# EAGLE schematic seamonster_smd_draft1 (EAGLE 8.2.1)

## Sheet 1 of 4: Power Section
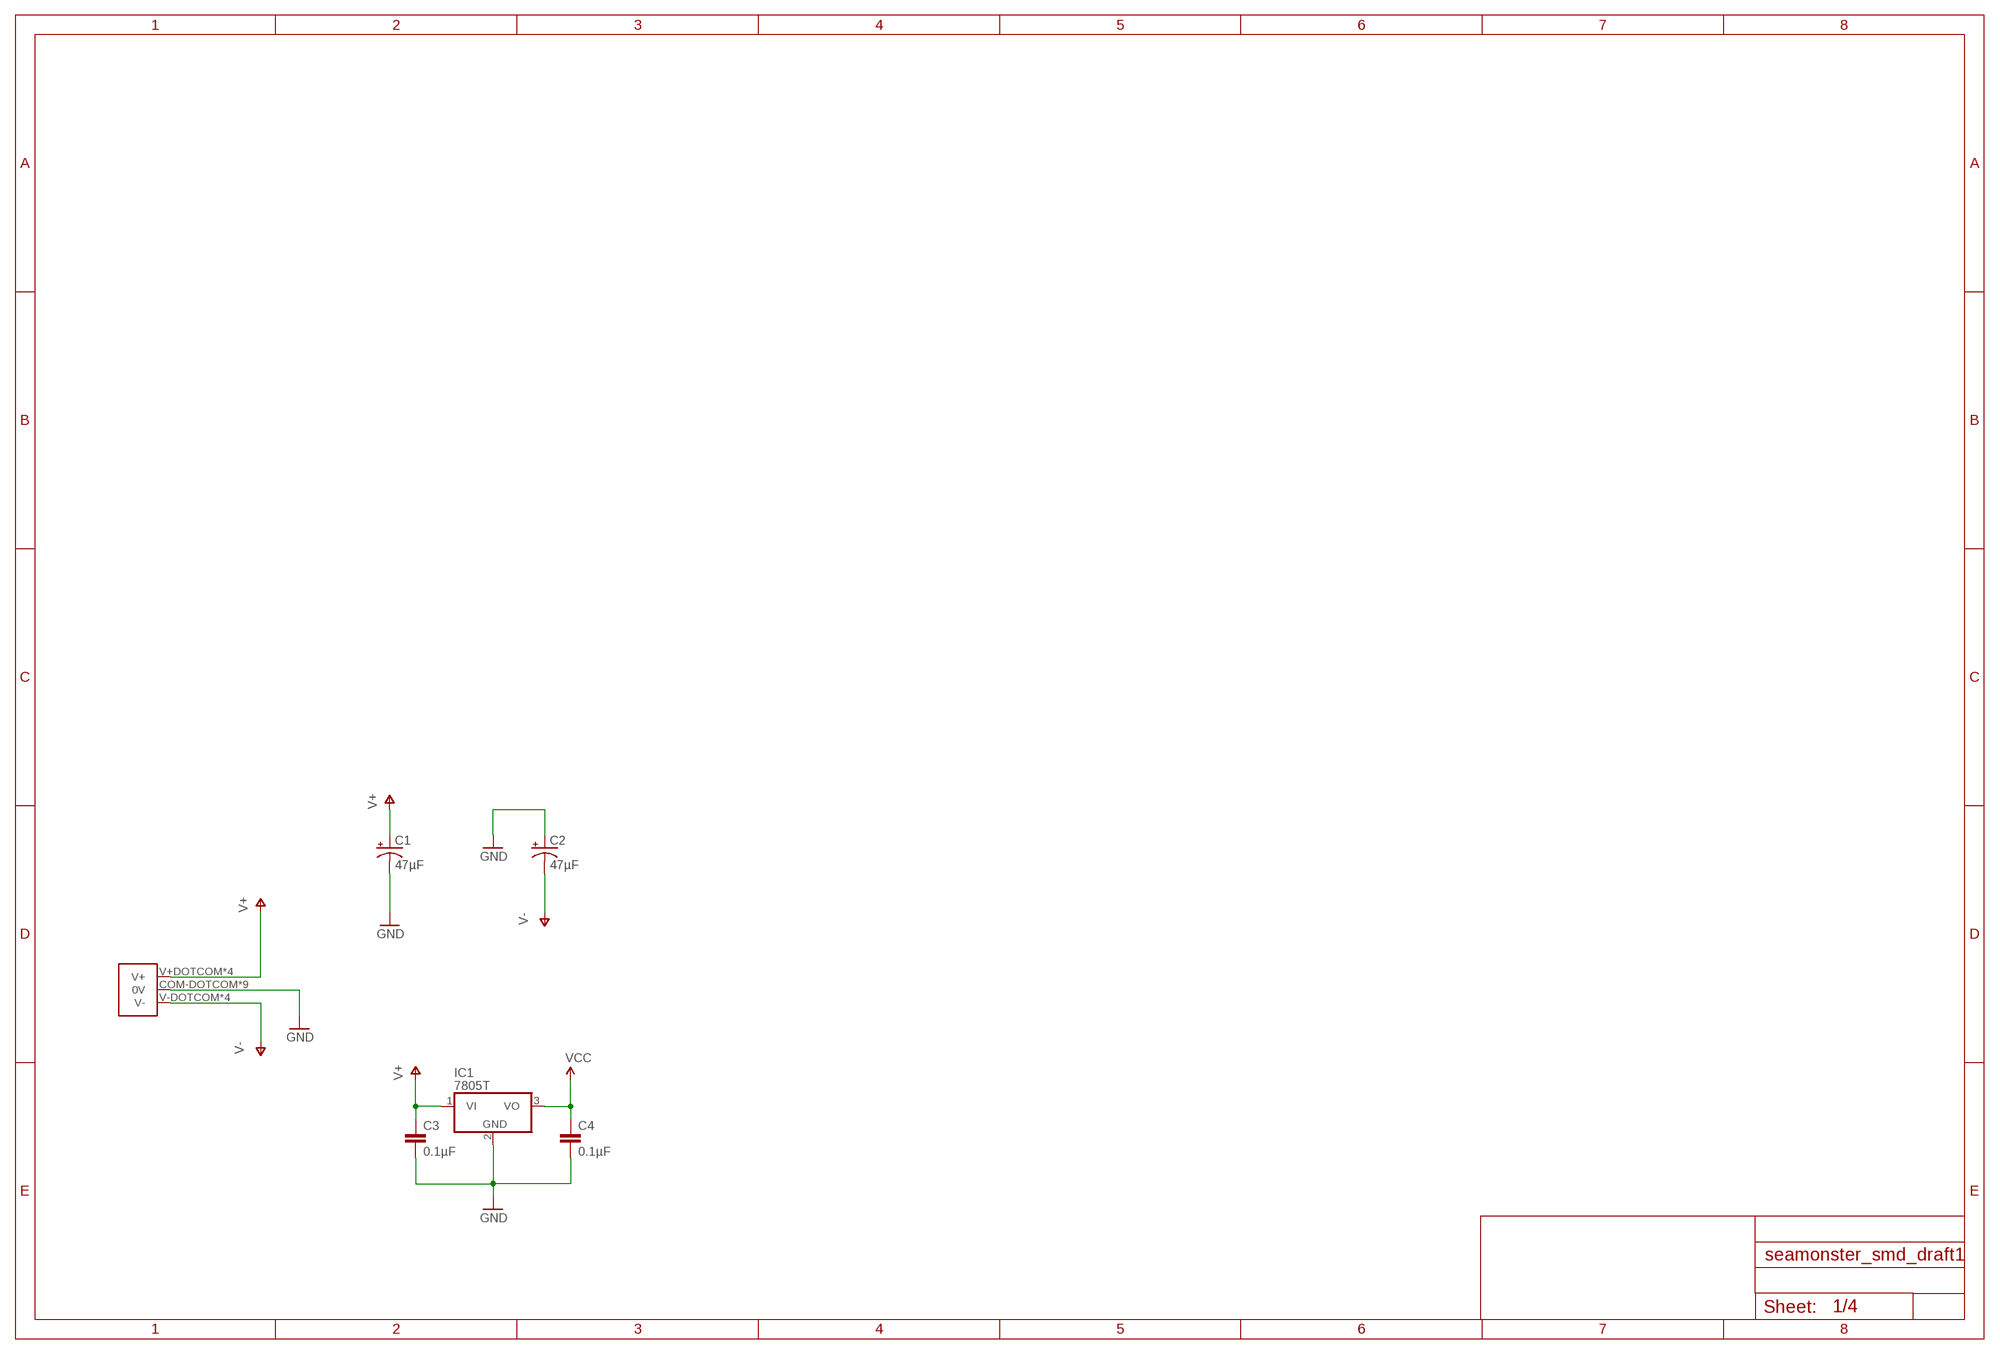
[diagram p0: schematic, sheet 1]

### Parts
C1  47µF  CAP_POLPTH2  [CPOL-RADIAL-10UF-25V]
C2  47µF  CAP_POLPTH2  [CPOL-RADIAL-10UF-25V]
C3  0.1µF  CAP0805  [0805]
C4  0.1µF  CAP0805  [0805]
IC1  7805T  [TO220H]
U$1  COMBO_POWER  [COMBO_POWER]

### Nets
GND: C1.2(-) C2.1(+) C3.2 C4.2 IC1.2(GND) U$1.COM-DOTCOM(0V) U$1.COM-EURO1(0V) U$1.COM-EURO2(0V) U$1.COM-EURO3(0V) U$1.COM-EURO4(0V) U$1.COM-EURO5(0V) U$1.COM-EURO6(0V) U$1.COM-MOTM1(0V) U$1.COM_MOTM2(0V) ; also sheet 2
V+: C1.1(+) C3.1 IC1.1(VI) U$1.V+DOTCOM(V+) U$1.V+EURO1(V+) U$1.V+EURO2(V+) U$1.V+MOTM(V+) ; also sheet 2
V-: C2.2(-) U$1.V-DOTCOM(V-) U$1.V-EURO1(V-) U$1.V-EURO2(V-) U$1.V-MOTM(V-) ; also sheet 2
VCC: C4.1 IC1.3(VO) ; also sheet 2

## Sheet 2 of 4: Multiplexing
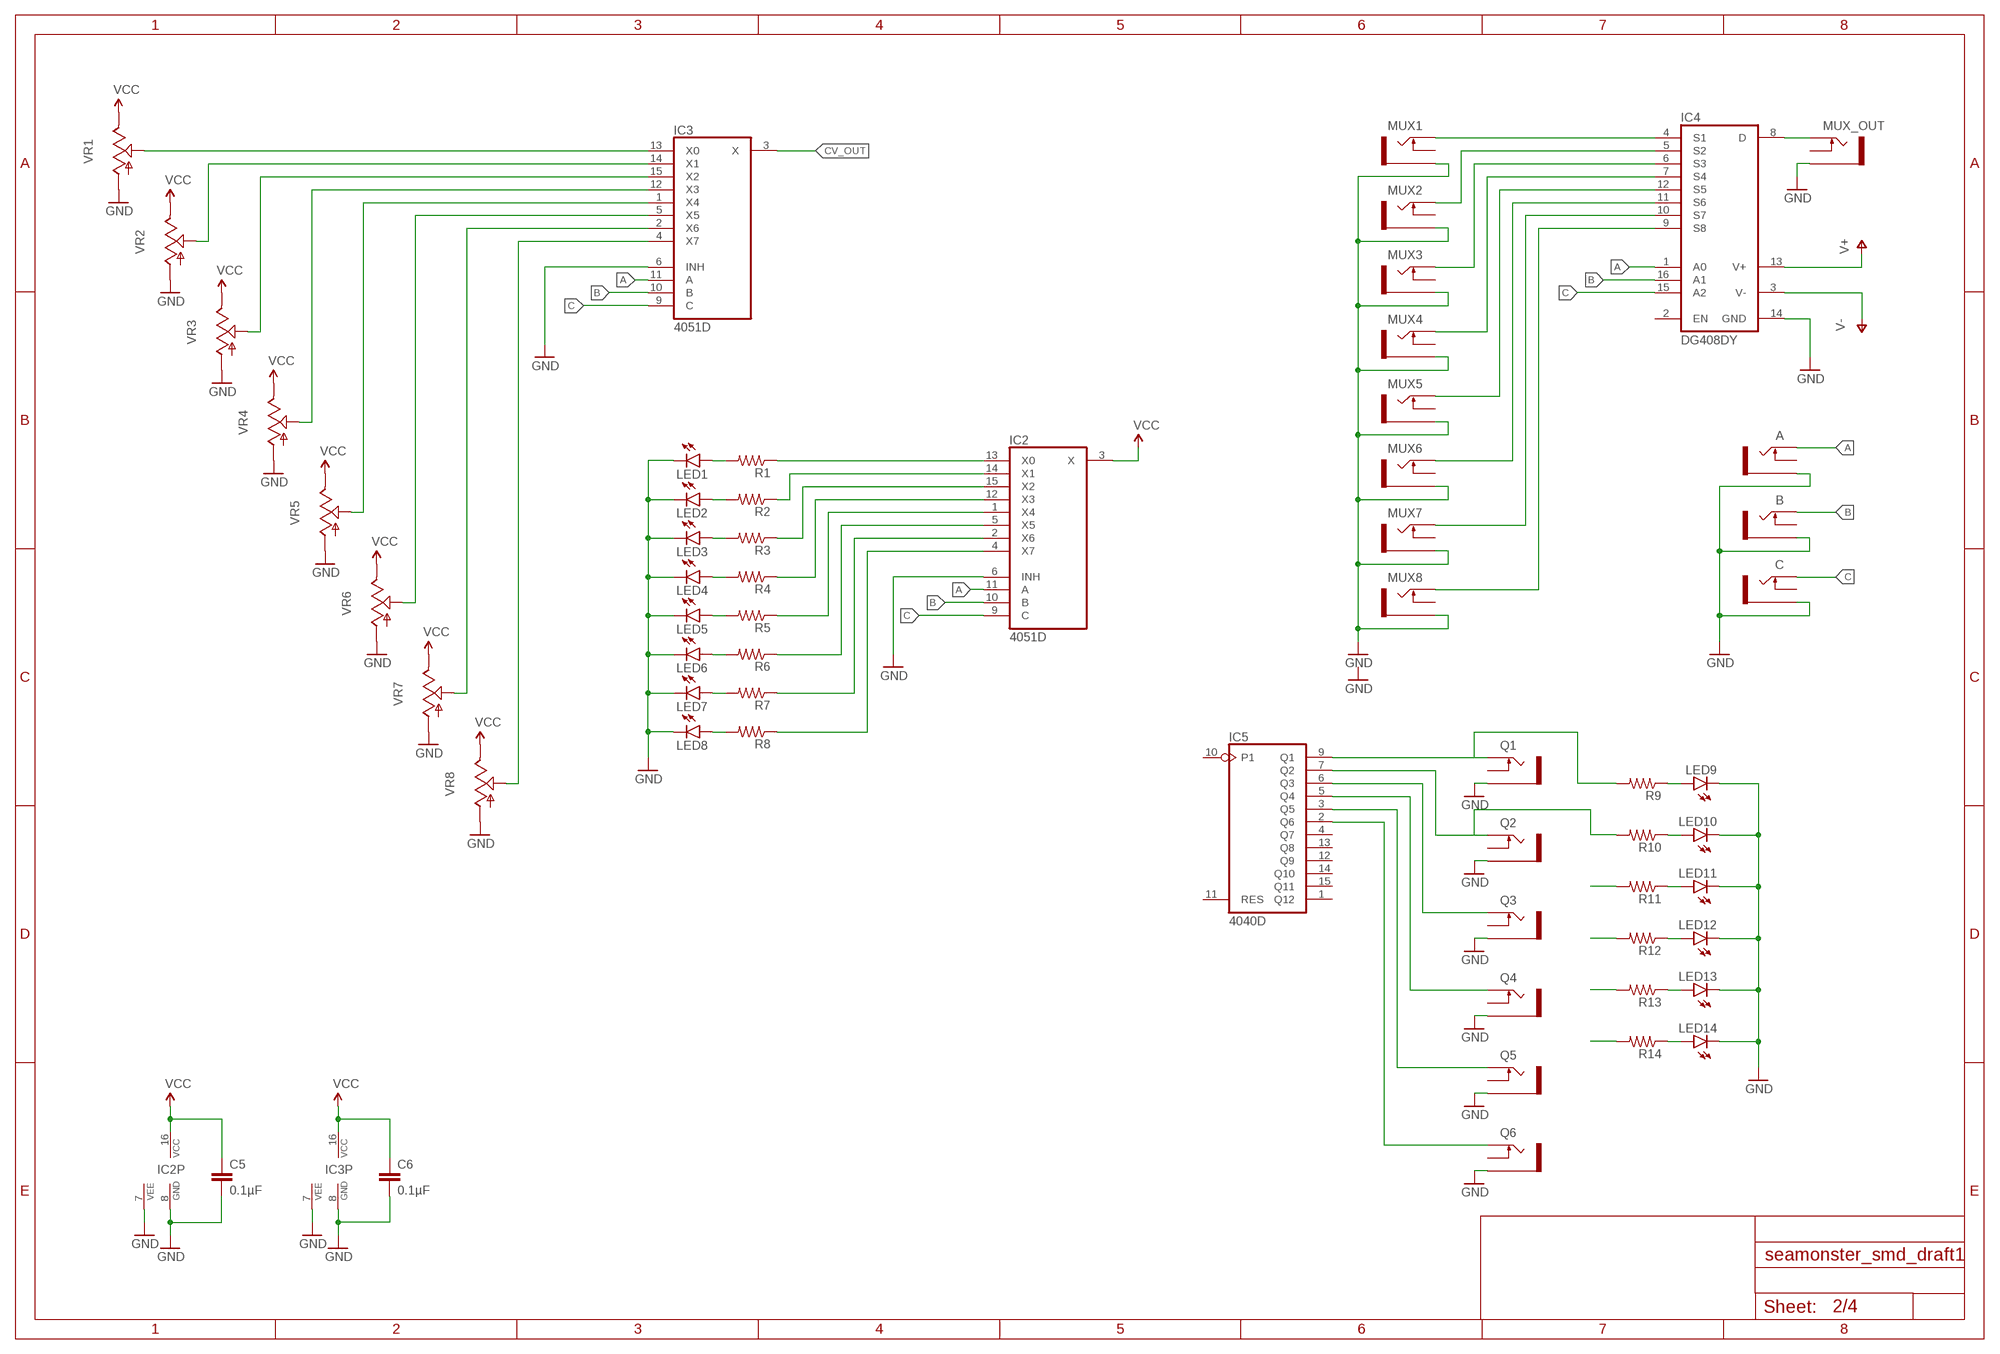
[diagram p1: schematic, sheet 2]

### Parts
A  THONKICONNNEW  [WQP-PJ301M-12_JACK]
B  THONKICONNNEW  [WQP-PJ301M-12_JACK]
C  THONKICONNNEW  [WQP-PJ301M-12_JACK]
C5  0.1µF  CAP0805  [0805]
C6  0.1µF  CAP0805  [0805]
IC2  4051D  [SO16]
IC3  4051D  [SO16]
IC4  DG408DY  [SO16]
IC5  4040D  [SO16]
LED1  LED3MM  [LED3MM]
LED2  LED3MM  [LED3MM]
LED3  LED3MM  [LED3MM]
LED4  LED3MM  [LED3MM]
LED5  LED3MM  [LED3MM]
LED6  LED3MM  [LED3MM]
LED7  LED3MM  [LED3MM]
LED8  LED3MM  [LED3MM]
LED9  LED3MM  [LED3MM]
LED10  LED3MM  [LED3MM]
LED11  LED3MM  [LED3MM]
LED12  LED3MM  [LED3MM]
LED13  LED3MM  [LED3MM]
LED14  LED3MM  [LED3MM]
MUX1  THONKICONNNEW  [WQP-PJ301M-12_JACK]
MUX2  THONKICONNNEW  [WQP-PJ301M-12_JACK]
MUX3  THONKICONNNEW  [WQP-PJ301M-12_JACK]
MUX4  THONKICONNNEW  [WQP-PJ301M-12_JACK]
MUX5  THONKICONNNEW  [WQP-PJ301M-12_JACK]
MUX6  THONKICONNNEW  [WQP-PJ301M-12_JACK]
MUX7  THONKICONNNEW  [WQP-PJ301M-12_JACK]
MUX8  THONKICONNNEW  [WQP-PJ301M-12_JACK]
MUX_OUT  THONKICONNNEW  [WQP-PJ301M-12_JACK]
Q1  THONKICONNNEW  [WQP-PJ301M-12_JACK]
Q2  THONKICONNNEW  [WQP-PJ301M-12_JACK]
Q3  THONKICONNNEW  [WQP-PJ301M-12_JACK]
Q4  THONKICONNNEW  [WQP-PJ301M-12_JACK]
Q5  THONKICONNNEW  [WQP-PJ301M-12_JACK]
Q6  THONKICONNNEW  [WQP-PJ301M-12_JACK]
R1  RESISTOR0805-RES  [0805]
R2  RESISTOR0805-RES  [0805]
R3  RESISTOR0805-RES  [0805]
R4  RESISTOR0805-RES  [0805]
R5  RESISTOR0805-RES  [0805]
R6  RESISTOR0805-RES  [0805]
R7  RESISTOR0805-RES  [0805]
R8  RESISTOR0805-RES  [0805]
R9  RESISTOR0805-RES  [0805]
R10  RESISTOR0805-RES  [0805]
R11  RESISTOR0805-RES  [0805]
R12  RESISTOR0805-RES  [0805]
R13  RESISTOR0805-RES  [0805]
R14  RESISTOR0805-RES  [0805]
VR1  9MM_SNAP-IN_POT_  [9MM_SNAP-IN_POT]
VR2  9MM_SNAP-IN_POT_  [9MM_SNAP-IN_POT]
VR3  9MM_SNAP-IN_POT_  [9MM_SNAP-IN_POT]
VR4  9MM_SNAP-IN_POT_  [9MM_SNAP-IN_POT]
VR5  9MM_SNAP-IN_POT_  [9MM_SNAP-IN_POT]
VR6  9MM_SNAP-IN_POT_  [9MM_SNAP-IN_POT]
VR7  9MM_SNAP-IN_POT_  [9MM_SNAP-IN_POT]
VR8  9MM_SNAP-IN_POT_  [9MM_SNAP-IN_POT]

### Nets
A: A.P$1_TIP(TIP) IC2.11(A) IC3.11(A) IC4.1(A0)
B: B.P$1_TIP(TIP) IC2.10(B) IC3.10(B) IC4.16(A1)
C: C.P$1_TIP(TIP) IC2.9(C) IC3.9(C) IC4.15(A2)
CV_OUT: IC3.3(X)
GND: A.P$3_SLEEVE(SLEEVE) B.P$3_SLEEVE(SLEEVE) C5.2 C6.2 C.P$3_SLEEVE(SLEEVE) IC2.6(INH) IC2.7(VEE) IC2.8(GND) IC3.6(INH) IC3.7(VEE) IC3.8(GND) IC4.14(GND) LED1.K(C) LED2.K(C) LED3.K(C) LED4.K(C) LED5.K(C) LED6.K(C) LED7.K(C) LED8.K(C) LED9.K(C) LED10.K(C) LED11.K(C) LED12.K(C) LED13.K(C) LED14.K(C) MUX1.P$3_SLEEVE(SLEEVE) MUX2.P$3_SLEEVE(SLEEVE) MUX3.P$3_SLEEVE(SLEEVE) MUX4.P$3_SLEEVE(SLEEVE) MUX5.P$3_SLEEVE(SLEEVE) MUX6.P$3_SLEEVE(SLEEVE) MUX7.P$3_SLEEVE(SLEEVE) MUX8.P$3_SLEEVE(SLEEVE) MUX_OUT.P$3_SLEEVE(SLEEVE) Q1.P$3_SLEEVE(SLEEVE) Q2.P$3_SLEEVE(SLEEVE) Q3.P$3_SLEEVE(SLEEVE) Q4.P$3_SLEEVE(SLEEVE) Q5.P$3_SLEEVE(SLEEVE) Q6.P$3_SLEEVE(SLEEVE) VR1.1(A) VR2.1(A) VR3.1(A) VR4.1(A) VR5.1(A) VR6.1(A) VR7.1(A) VR8.1(A) ; also sheet 1
N$1: IC4.8(D) MUX_OUT.P$1_TIP(TIP)
N$2: IC4.4(S1) MUX1.P$1_TIP(TIP)
N$3: IC4.5(S2) MUX2.P$1_TIP(TIP)
N$4: IC4.6(S3) MUX3.P$1_TIP(TIP)
N$5: IC4.7(S4) MUX4.P$1_TIP(TIP)
N$6: IC4.12(S5) MUX5.P$1_TIP(TIP)
N$7: IC4.11(S6) MUX6.P$1_TIP(TIP)
N$8: IC4.10(S7) MUX7.P$1_TIP(TIP)
N$9: IC4.9(S8) MUX8.P$1_TIP(TIP)
N$10: LED1.A R1.2
N$11: LED2.A R2.2
N$12: LED3.A R3.2
N$13: LED4.A R4.2
N$14: LED5.A R5.2
N$15: LED6.A R6.2
N$16: LED7.A R7.2
N$17: LED8.A R8.2
N$18: IC3.13(X0) VR1.2(S)
N$19: IC2.13(X0) R1.1
N$20: IC2.14(X1) R2.1
N$21: IC2.15(X2) R3.1
N$22: IC2.12(X3) R4.1
N$23: IC2.1(X4) R5.1
N$24: IC2.5(X5) R6.1
N$25: IC2.2(X6) R7.1
N$26: IC2.4(X7) R8.1
N$27: IC3.14(X1) VR2.2(S)
N$28: IC3.15(X2) VR3.2(S)
N$29: IC3.12(X3) VR4.2(S)
N$30: IC3.1(X4) VR5.2(S)
N$31: IC3.5(X5) VR6.2(S)
N$32: IC3.2(X6) VR7.2(S)
N$33: IC3.4(X7) VR8.2(S)
N$34: LED9.A R9.1
N$35: LED10.A R10.1
N$36: LED11.A R11.1
N$37: LED12.A R12.1
N$38: LED13.A R13.1
N$39: LED14.A R14.1
N$40: IC5.9(Q1) Q1.P$1_TIP(TIP) R9.2
N$41: IC5.7(Q2) Q2.P$1_TIP(TIP) R10.2
N$42: IC5.6(Q3) Q3.P$1_TIP(TIP)
N$43: IC5.5(Q4) Q4.P$1_TIP(TIP)
N$44: IC5.3(Q5) Q5.P$1_TIP(TIP)
N$45: IC5.2(Q6) Q6.P$1_TIP(TIP)
N$48: R11.2
N$49: R12.2
N$50: R13.2
N$51: R14.2
V+: IC4.13(V+) ; also sheet 1
V-: IC4.3(V-) ; also sheet 1
VCC: C5.1 C6.1 IC2.3(X) IC2.16(VCC) IC3.16(VCC) VR1.3(E) VR2.3(E) VR3.3(E) VR4.3(E) VR5.3(E) VR6.3(E) VR7.3(E) VR8.3(E) ; also sheet 1
Unconnected: A.P$2_SWITCH(SWITCH) B.P$2_SWITCH(SWITCH) C.P$2_SWITCH(SWITCH) IC4.2(EN) IC5.1(Q12) IC5.4(Q7) IC5.10(P1) IC5.11(RES) IC5.12(Q9) IC5.13(Q8) IC5.14(Q10) IC5.15(Q11) MUX1.P$2_SWITCH(SWITCH) MUX2.P$2_SWITCH(SWITCH) MUX3.P$2_SWITCH(SWITCH) MUX4.P$2_SWITCH(SWITCH) MUX5.P$2_SWITCH(SWITCH) MUX6.P$2_SWITCH(SWITCH) MUX7.P$2_SWITCH(SWITCH) MUX8.P$2_SWITCH(SWITCH) MUX_OUT.P$2_SWITCH(SWITCH) Q1.P$2_SWITCH(SWITCH) Q2.P$2_SWITCH(SWITCH) Q3.P$2_SWITCH(SWITCH) Q4.P$2_SWITCH(SWITCH) Q5.P$2_SWITCH(SWITCH) Q6.P$2_SWITCH(SWITCH)

## Sheet 3 of 4: Oscillators
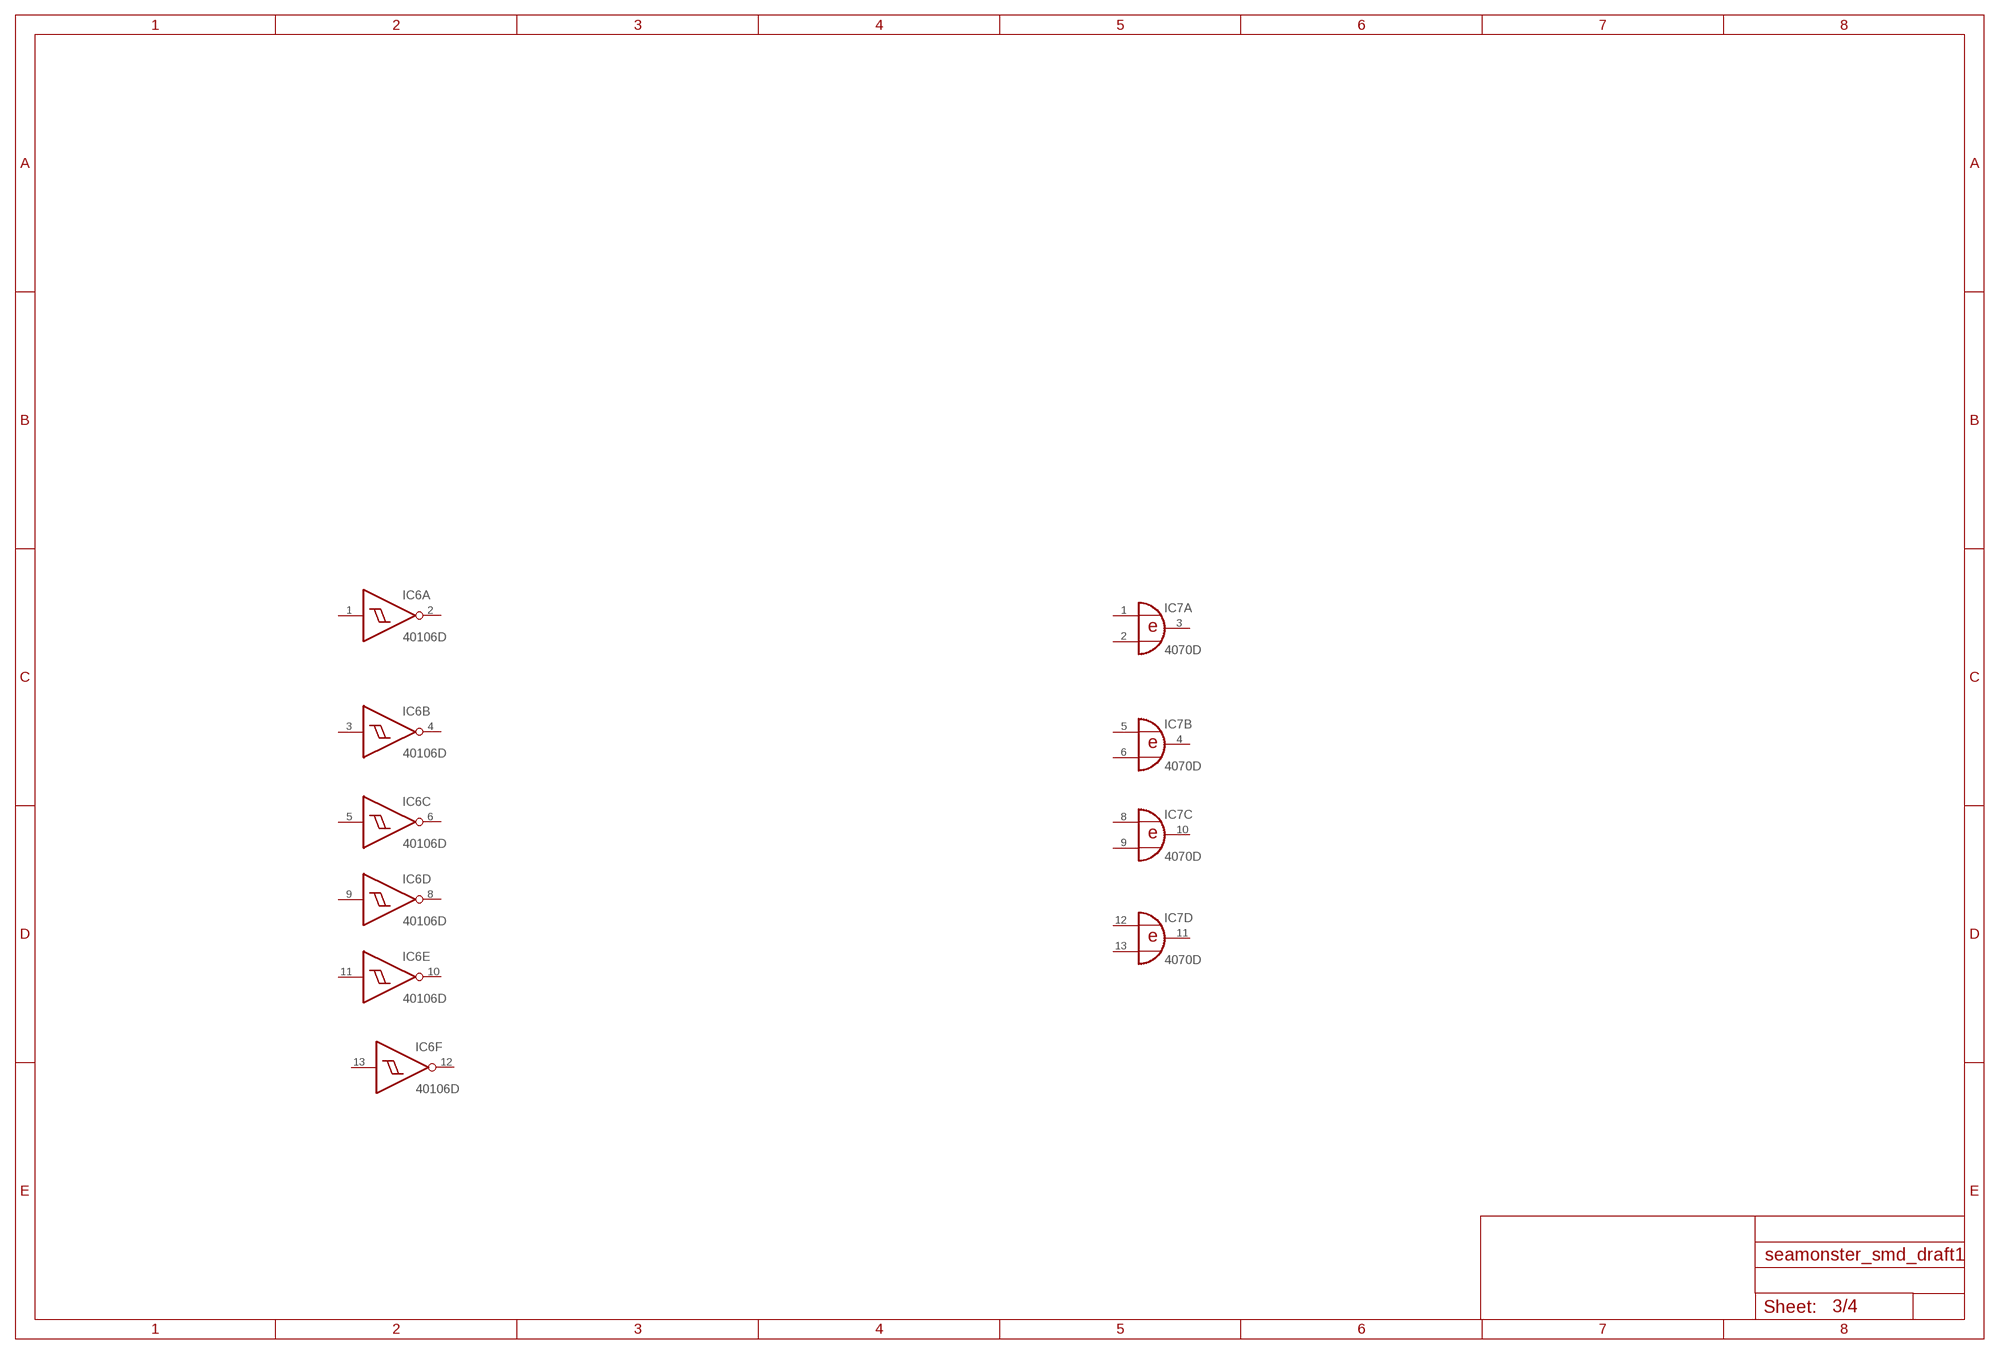
[diagram p2: schematic, sheet 3]

### Parts
IC6  40106D  [SO14]
IC7  4070D  [SO14]
Unconnected: IC6.1(A:I) IC6.2(A:O) IC6.3(B:I) IC6.4(B:O) IC6.5(C:I) IC6.6(C:O) IC6.8(D:O) IC6.9(D:I) IC6.10(E:O) IC6.11(E:I) IC6.12(F:O) IC6.13(F:I) IC7.1(A:I0) IC7.2(A:I1) IC7.3(A:O) IC7.4(B:O) IC7.5(B:I0) IC7.6(B:I1) IC7.8(C:I0) IC7.9(C:I1) IC7.10(C:O) IC7.11(D:O) IC7.12(D:I0) IC7.13(D:I1)

## Sheet 4 of 4: Buffering
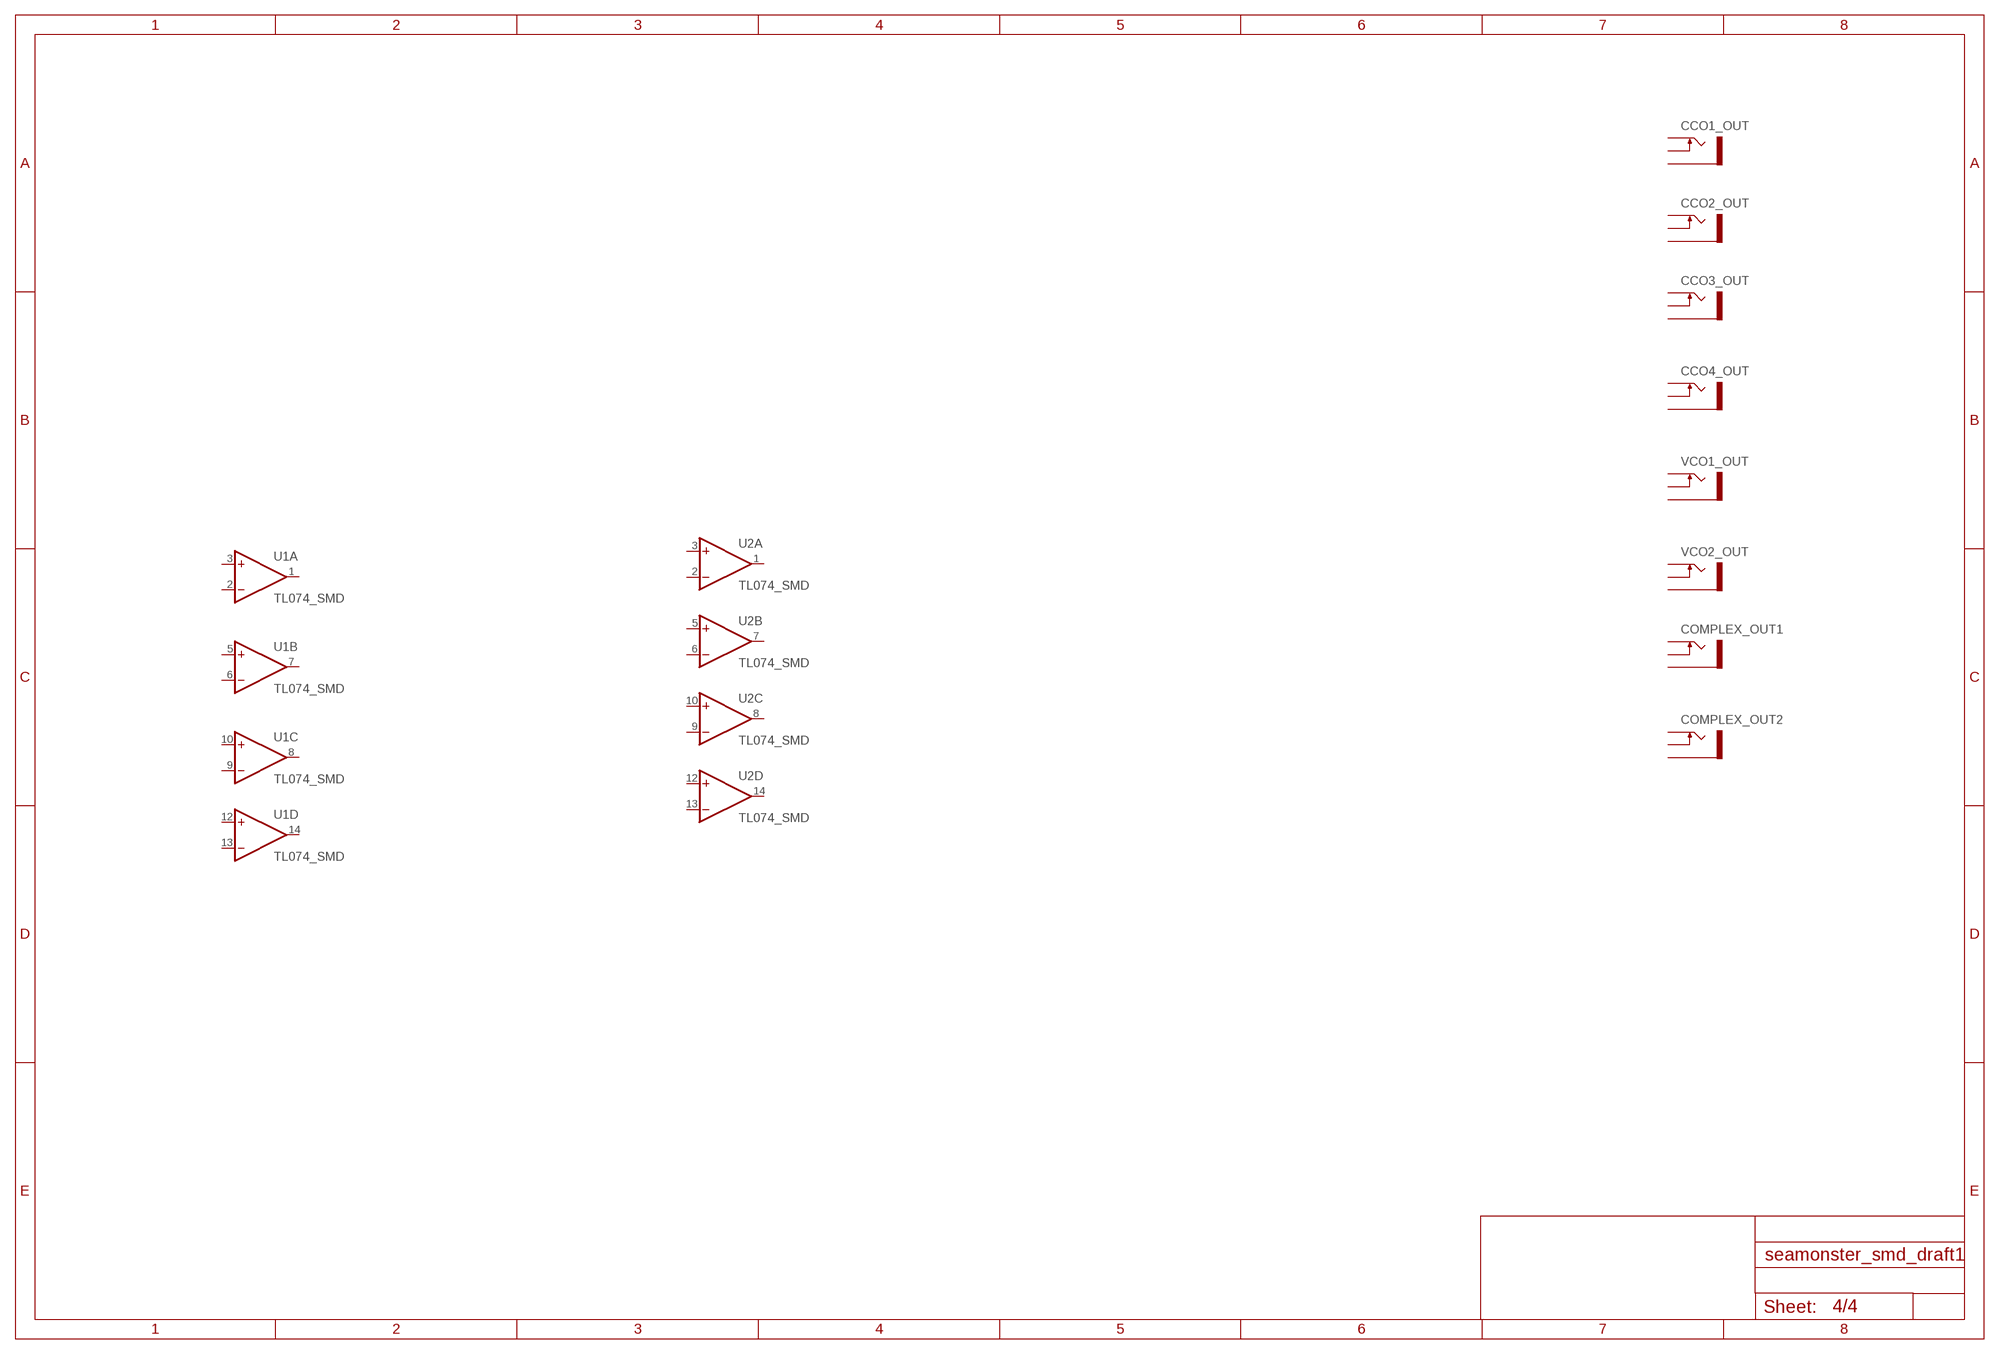
[diagram p3: schematic, sheet 4]

### Parts
CCO1_OUT  THONKICONNNEW  [WQP-PJ301M-12_JACK]
CCO2_OUT  THONKICONNNEW  [WQP-PJ301M-12_JACK]
CCO3_OUT  THONKICONNNEW  [WQP-PJ301M-12_JACK]
CCO4_OUT  THONKICONNNEW  [WQP-PJ301M-12_JACK]
COMPLEX_OUT1  THONKICONNNEW  [WQP-PJ301M-12_JACK]
COMPLEX_OUT2  THONKICONNNEW  [WQP-PJ301M-12_JACK]
U1  TL074_SMD  [SO14]
U2  TL074_SMD  [SO14]
VCO1_OUT  THONKICONNNEW  [WQP-PJ301M-12_JACK]
VCO2_OUT  THONKICONNNEW  [WQP-PJ301M-12_JACK]
Unconnected: CCO1_OUT.P$1_TIP(TIP) CCO1_OUT.P$2_SWITCH(SWITCH) CCO1_OUT.P$3_SLEEVE(SLEEVE) CCO2_OUT.P$1_TIP(TIP) CCO2_OUT.P$2_SWITCH(SWITCH) CCO2_OUT.P$3_SLEEVE(SLEEVE) CCO3_OUT.P$1_TIP(TIP) CCO3_OUT.P$2_SWITCH(SWITCH) CCO3_OUT.P$3_SLEEVE(SLEEVE) CCO4_OUT.P$1_TIP(TIP) CCO4_OUT.P$2_SWITCH(SWITCH) CCO4_OUT.P$3_SLEEVE(SLEEVE) COMPLEX_OUT1.P$1_TIP(TIP) COMPLEX_OUT1.P$2_SWITCH(SWITCH) COMPLEX_OUT1.P$3_SLEEVE(SLEEVE) COMPLEX_OUT2.P$1_TIP(TIP) COMPLEX_OUT2.P$2_SWITCH(SWITCH) COMPLEX_OUT2.P$3_SLEEVE(SLEEVE) U1.1(A:OUT) U1.2(A:-IN) U1.3(A:+IN) U1.5(B:+IN) U1.6(B:-IN) U1.7(B:OUT) U1.8(C:OUT) U1.9(C:-IN) U1.10(C:+IN) U1.12(D:+IN) U1.13(D:-IN) U1.14(D:OUT) U2.1(A:OUT) U2.2(A:-IN) U2.3(A:+IN) U2.5(B:+IN) U2.6(B:-IN) U2.7(B:OUT) U2.8(C:OUT) U2.9(C:-IN) U2.10(C:+IN) U2.12(D:+IN) U2.13(D:-IN) U2.14(D:OUT) VCO1_OUT.P$1_TIP(TIP) VCO1_OUT.P$2_SWITCH(SWITCH) VCO1_OUT.P$3_SLEEVE(SLEEVE) VCO2_OUT.P$1_TIP(TIP) VCO2_OUT.P$2_SWITCH(SWITCH) VCO2_OUT.P$3_SLEEVE(SLEEVE)

## Power pins joined to a net without a drawn wire
V+: U1.4(P:V+) U2.4(P:V+)
V-: U1.11(P:V-) U2.11(P:V-)
VDD: IC5.16(VDD) IC6.14(P:VDD) IC7.14(P:VDD)
VSS: IC5.8(VSS) IC6.7(P:VSS) IC7.7(P:VSS)

## Library data of the parts
A B C CCO1_OUT CCO2_OUT CCO3_OUT CCO4_OUT COMPLEX_OUT1 COMPLEX_OUT2 MUX1-MUX8 MUX_OUT Q1-Q6 VCO1_OUT VCO2_OUT = MusicThingModular:THONKICONN: 3.5mm socket for Eurorack modular synths
C1 C2 = SparkFun-Capacitors:CAP_POL: Capacitor Polarized These are standard SMD and PTH capacitors. Normally 10uF, 47uF, and 100uF in electrolytic and tantalum varieties. Always verify the external diameter of the through hole cap, it varies with capacity, voltage, and manufacturer. The EIA devices should be standard.
C3-C6 = SparkFun-Capacitors:CAP: Capacitor Standard 0603 ceramic capacitor, and 0.1" leaded capacitor.
IC1 = linear:78*: Positive VOLTAGE REGULATOR Source: http://cache.national.com/ds/LM/LM78L05.pdf http://www.fairchildsemi.com/ds/LM/LM7805.pdf
IC2 IC3 = 40xx:4051: 8-channel ANALOG MULTIPLEXER
IC4 = maxim:DG408DY: ANALOG MULTIPLEXER; MPN: DG408DY+T; OC_FARNELL: 1077070; OC_NEWARK: 67K3719
IC5 = 40xx:4040: 12-stage binary/ripple COUNTER
IC6 = 40xx:40106: Hex SCHMITT TRIGGER
IC7 = 40xx:4070: Quad 2-input XOR
LED1-LED14 = SparkFun-LED:LED: LEDs Standard schematic elements and footprints for 5mm, 3mm, 1206, and 0603 sized LEDs. 5mm - Spark Fun Electronics SKU : COM-00529 (and others)
R1-R14 = SparkFun-Resistors:RESISTOR: Resistor Basic schematic elements and footprints for 0603, 1206, and PTH resistors.
U1 U2 = MusicThingModular:TL074: Generic Quad Op Amp
U$1 = combo_power:COMBO_POWER
VR1-VR8 = MusicThingModular:9MM_SNAP-IN_POT: 9mm vertical snap-in pot, Alpha / Panasonic style